# Altium schematic sheet ESP32-2-System.SchDoc
size A; SheetNumber: 2; SheetTotal: 2
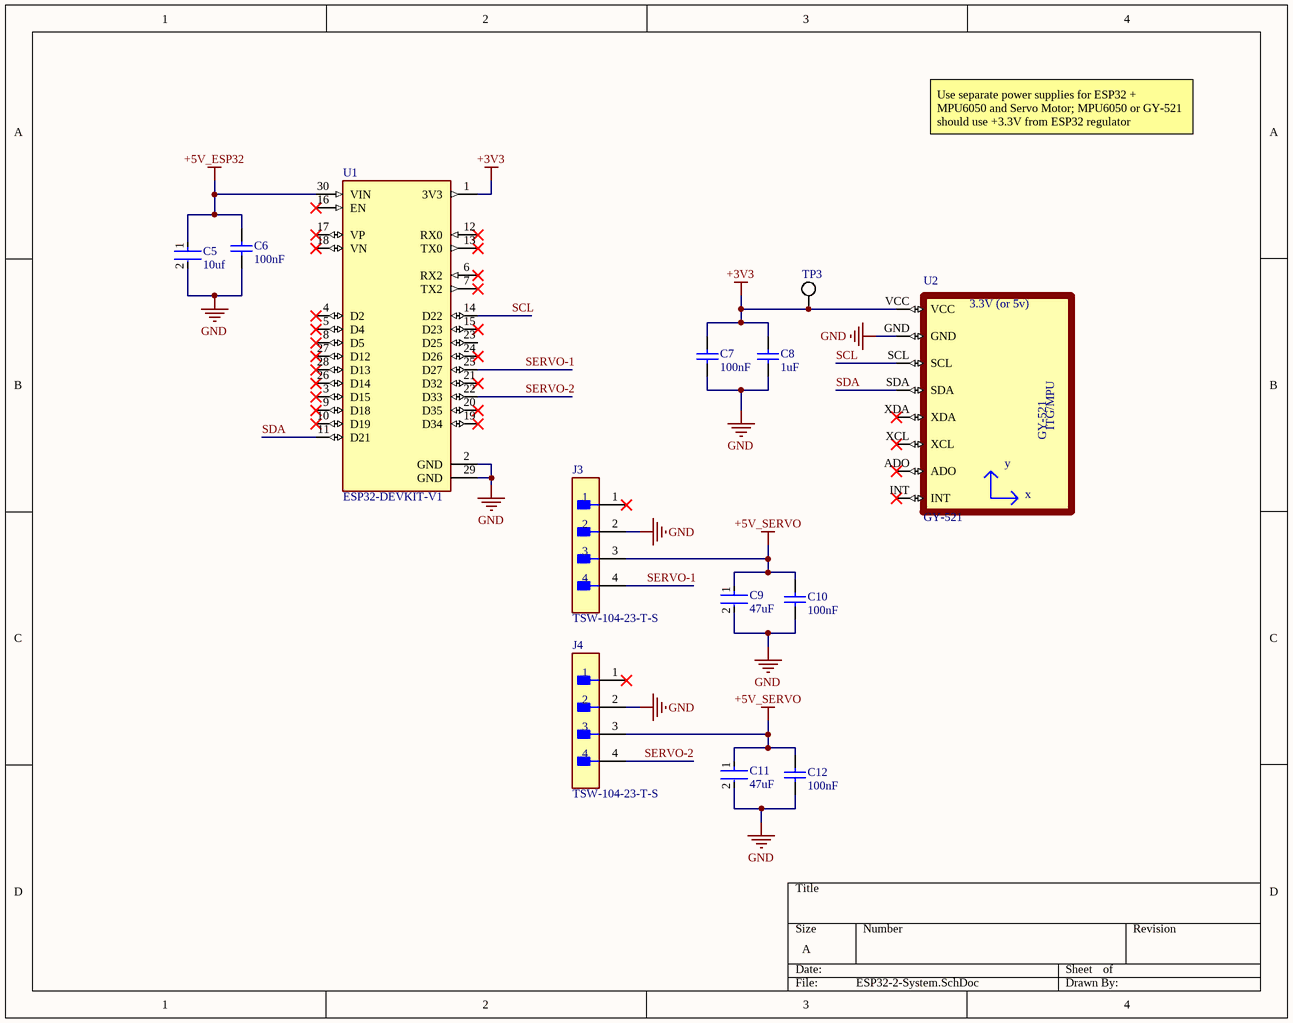
[diagram p0: ESP32-2-System.SchDoc]

## Parts
C5  10uf  [FP-GCJ31C-0_3-IPC_C]
C6  100nF  [CAPC1206(3216)170_L]
C7  100nF  [CAPC1206(3216)170_L]
C8  1uF  [CAPC1206(3216)170_L]
C9  47uF  [FP-CL32-IPC_C]
C10  100nF  [CAPC1206(3216)170_L]
C11  47uF  [FP-CL32-IPC_C]
C12  100nF  [CAPC1206(3216)170_L]
J3  TSW-104-23-T-S  [FP-TSW-104-23-T-S-MFG]
J4  TSW-104-23-T-S  [FP-TSW-104-23-T-S-MFG]
TP3  Test Point  [Test Point]  (value not drawn)
U1  ESP32-DEVKIT-V1  [MODULE_ESP32_DEVKIT_V1]
U2  GY-521  [GY-521]

## Nets
+3V3: C7.2 C8.2 TP3.1 U1.1(3V3) U2.VCC
+5V_ESP32: C5.1 C6.2 U1.30(VIN)
+5V_SERVO: C9.1 C10.2 C11.1 C12.2 J3.3 J4.3
GND: C5.2 C6.1 C7.1 C8.1 C9.2 C10.1 C11.2 C12.1 J3.2 J4.2 U1.2(GND) U1.29(GND) U2.GND
SCL: U1.14(D22) U2.SCL
SDA: U1.11(D21) U2.SDA
SERVO-1: J3.4 U1.25(D27)
SERVO-2: J4.4 U1.22(D33)

Not connected (* = marked no-connect by the designer): J3 1*; J4 1*; U1 3(D15)* 4(D2)* 5(D4)* 6(RX2)* 7(TX2)* 8(D5)* 9(D18)* 10(D19)* 12(RX0)* 13(TX0)* 15(D23)* 16(EN)* 17(VP)* 18(VN)* 19(D34)* 20(D35)* 21(D32)* 23(D25) 24(D26)* 26(D14)* 27(D12)* 28(D13)*; U2 ADO* INT* XCL* XDA*

## Notes on the sheet
- Use separate power supplies for ESP32 + MPU6050 and Servo Motor; MPU6050 or GY-521 should use +3.3V from ESP32 regulator
- (in symbol CMP-010-000000-1) 3.3V (or 5v); ITG/MPU; y; x

## Library data of the parts
C5 = CMP-06035-052008-1: Cap Ceramic 10uF 10V X7R 10% Pad SMD 1206 Soft Termination  +125°C Automotive T/R; Min Operating Temperature: -55°C; Package Quantity: 2000; Voltage Rating: 10V; Voltage Rating (DC): 10V; Features: Soft Termination; Tolerance: 10%; Max Operating Temperature: 125°C; Length: 3.2mm; Case/Package: 1206; Dielectric: X7R; Thickness: 0.063inch; Case Code (Metric): 3216; Lead Free: Lead Free; Height: 1.6mm; Packaging: Tape and Reel; Case Code (Imperial): 1206; Ratings: AEC-Q200; Voltage: 10V; Width: 0.063inch; Capacitance: 10uF; Mount: Surface Mount; Depth: 1.6mm; Termination: SMD/SMT
C6 C7 C10 C12 = CMP-1037-04201-1: CAP 100nF 50V ±10% 1206 (3216 Metric) Thickness 1.7mm SMD; Case-Metric: 3216; Tolerance: Â±10%; Case-EIA: 1206; Value: 100nF; Max Thickness: 1.7 mm; Rated Voltage: 50 V; Technology: SMT
C8 = CMP-1037-04687-1: CAP 1uF 16V ±10% 1206 (3216 Metric) Thickness 1.7mm SMD; Case-EIA: 1206; Tolerance: Â±10%; Case-Metric: 3216; Rated Voltage: 16 V; Max Thickness: 1.7 mm; Technology: SMT; Value: 1uF
C9 C11 = CMP-13271-000441-1: Cap Ceramic 47uF 16V X5R ±20% SMD 1210 +85°C Embossed T/R; CL32A476MOJNNWE
J3 J4 = CMP-02766-001388-1: CONN HEADER VERT 4POS 2.54MM; Number of Contacts: 4; Gender: Male; Connector Type: Male Pin; Max Voltage Rating (AC): 550V; Max Current Rating: 7.6A; Radiation Hardening: No; Lead Free: Lead Free; RoHS Compliant: Yes; Contact Material: Bronze; Number of Positions: 4; Housing Color: Black; Min Operating Temperature: -55°C; Mount: Through Hole; Number of Rows: 1; Orientation: Straight; Contact Mating Length: 0.23inch; Contact Type: Male Pin; REACH SVHC: No SVHC; Max Operating Temperature: 105°C; Color: Black; Pitch: 2.54mm; Length: 10.16mm; Series: TSW; Packaging: Bulk; Contact Plating: Tin; Package Quantity: 1; Termination: Solder; Housing Material: Polyester; Width: 2.54mm; Depth: 2.54mm
TP3 = CMP-00030-00006-7
U1 = CMP-008-000000-1: Dual core, Wi-Fi: 2.4 GHz up to 150 Mbits/s,BLE (Bluetooth Low Energy) and legacy Bluetooth, 32 bits, Up to 240 MHz; MF: Do it; Value: *; SnapEDA_Link: https://www.snapeda.com/parts/ESP32-DEVKIT-V1/Do+it/view-part/?ref=snap; MP: ESP32-DEVKIT-V1; Design Item ID: ESP32-DEVKIT-V1; Package: None; Check_prices: https://www.snapeda.com/parts/ESP32-DEVKIT-V1/Do+it/view-part/?ref=eda; Pin Count: 30; Component Type: Standard; Source: ESP32-DEVKIT-V1.SchLib
U2 = CMP-010-000000-1: Triple Axis Accelerometer Gyro Breakout; MF: GODREAM FORDREAM CO., LIMITED; Package: Package; Design Item ID: GY-521; Check_prices: https://www.snapeda.com/parts/GY-521/GODREAM+FORDREAM+CO.%252C+LIMITED/view-part/?ref=eda; SnapEDA_Link: https://www.snapeda.com/parts/GY-521/GODREAM+FORDREAM+CO.%252C+LIMITED/view-part/?ref=snap; Value: *; MP: GY-521; Pin Count: 8; Source: GY-521.SchLib; Component Type: Standard